# Altium schematic sheet Buck.SchDoc
size A4
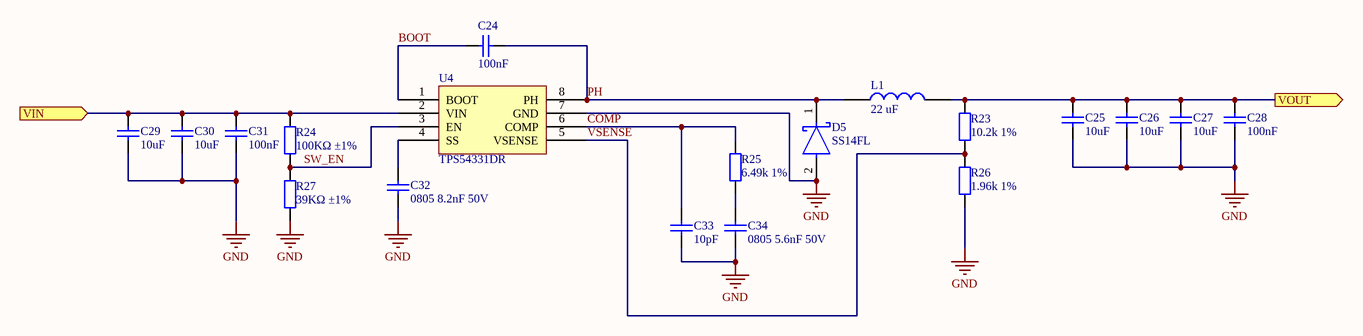
[diagram p0: Buck.SchDoc]

## Parts
C24  100nF  [0603_C]
C25  10uF  [0603_C]
C26  10uF  [0603_C]
C27  10uF  [0603_C]
C28  100nF  [0603_C]
C29  10uF  [0805_C]
C30  10uF  [0805_C]
C31  100nF  [0603_C]
C32  0805 8.2nF 50V  [0805_C]
C33  10pF  [0603_C]
C34  0805 5.6nF 50V  [0805_C]
D5  SS14FL  [FP-425AD-MFG]
L1  22 uF  [COBU-DR74-4R7-R_V]
R23  10.2k 1%  [1206_R]
R24  100KΩ ±1%  [0805_R]
R25  6.49k 1%  [0805_R]
R26  1.96k 1%  [1206_R]
R27  39KΩ ±1%  [0805_R]
U4  TPS54331DR  [SOIC-8_150mil]

## Ports
VIN (in), VOUT (out)

## Nets
GND: C25.1 C26.1 C27.1 C28.1 C29.1 C30.1 C31.1 C32.1 C33.1 C34.1 D5.2(A) R26.1 R27.1 U4.7(GND)
BOOT: C24.2 U4.1(BOOT)
COMP: C33.2 R25.2 U4.6(COMP)
PH: C24.1 D5.1(C) L1.1 U4.8(PH)
SW_EN: R24.2 R27.2 U4.3(EN)
VIN: C29.2 C30.2 C31.2 R24.1 U4.2(VIN) ; port VIN
VOUT: C25.2 C26.2 C27.2 C28.2 L1.2 R23.1 ; port VOUT
VSENSE: R23.2 R26.2 U4.5(VSENSE)
NetC32_2: C32.2 U4.4(SS)
NetC34_2: C34.2 R25.1

## Library data of the parts
C24 C28 C31 = 0603 100nF (104) 10% 50V: Chip capacitors; Manufacturer: YAGEO; PartNumber: CC0603KRX7R9BB104; Tolerance: 10%; Voltage: 50V; ComponentLink1Description: Supplier link; ComponentLink1URL: http://www.szlcsc.com/product/details_15331.html; Package: 0603; Supplier: LC; SuppliersPartNumber: C14663; Capacitance: 100nF
C25-C27 = 0603 10uF (106) 10% 10V: Chip capacitors; Manufacturer: Samsung Electro-Mechanics; PartNumber: CL10A106KP8NNNC; Tolerance: 10%; Voltage: 10V; ComponentLink1Description: Supplier link; ComponentLink1URL: http://www.szlcsc.com/product/details_20411.html; Package: 0603; Supplier: LC; SuppliersPartNumber: C19702; Capacitance: 10uF
C29 C30 = 0805 10uF (106) 10% 25V: Chip capacitors; Manufacturer: Samsung Electro-Mechanics; PartNumber: CL21A106KAYNNNE; Tolerance: 10%; Voltage: 25V; ComponentLink1Description: Supplier link; ComponentLink1URL: http://www.szlcsc.com/product/details_16532.html; Package: 0805; Supplier: LC; SuppliersPartNumber: C15850; Capacitance: 10uF
C32 = 0805 8.2nF 50V: PartNumber: CL21B822KBANNNC; LCSC: C170117
C33 = 0603 10pF (100) 5% 50V: Chip capacitors; Manufacturer: Samsung Electro-Mechanics; PartNumber: CL10C100JB8NNNC; Tolerance: 5%; Voltage: 50V; ComponentLink1Description: Supplier link; ComponentLink1URL: http://www.szlcsc.com/product/details_1986.html; Package: 0603; Supplier: LC; SuppliersPartNumber: C1634; Capacitance: 10pF
C34 = 0805 5.6nF 50V: PartNumber: CL21B562KBANNNC; LCSC: C153719
D5 = CMP-07162-000013-1: DIODE SCHOTTKY 40V 1A SOD123F; Manufacturer: ON Semiconductor; Max Junction Temp: +125°C; Value: 60pF; Max Surge Forward Current: 40A; Peak Reverse Current: 30uA; Device Class L3: Schottky Diodes; Reverse Voltage: 40V; Automotive: No; Temperature: -55°C to +125°C; Mouser Description: SS14FL Series 40 V 1 A Surface Mount Schottky Barrier Rectifier - SOD-123F; Octopart: https://octopart.com/ss14fl-on+semiconductor-84331601; Height: 1.08mm; Temperature Range Low: -55°C; Category: Diode; Lead Free: Yes; Device Class L1: Discrete Semiconductors; Digikey Description: DIODE SCHOTTKY 40V 1A SOD123F; RoHS: TRUE; ComponentLink2Description: Datasheet; Manufacturer Part Number: SS14FL; Forward Current: 1A; Capacitance: 60pF; Package: 425AD; Device Class L2: Diodes; Temperature Range High: +125°C; Max Repetitive Reverse Voltage: 40V; ComponentLink2URL: https://www.onsemi.com/pub/Collateral/SS14FL-D.PDF
L1 = SRP6540-5R6M
R23 = 1206 10.2k 1%: PartNumber: 1206W4F1022T5E; LCSC: C247410
R24 = 0805 100K (1003) 1%: Chip resistor; Manufacturer: Uniroyal Elec; Power: 1/8W; ComponentLink1Description: Supplier link; ComponentLink1URL: http://www.szlcsc.com/product/details_18095.html; Package: 0805; Supplier: LC; SuppliersPartNumber: C17407; Tolerance: 1%
R25 = 0805 6.49k 1%: PartNumber: 0805W8F6491T5E; LCSC: C17769
R26 = 1206 1.96k 1%: PartNumber: 1206W4F1022T5E; LCSC: C247410
R27 = 0805 39K (3902) 1%: Chip resistor; Manufacturer: Uniroyal Elec; Power: 1/8W; ComponentLink1Description: Supplier link; ComponentLink1URL: http://www.szlcsc.com/product/details_26569.html; Package: 0805; Supplier: LC; SuppliersPartNumber: C25826; Tolerance: 1%
U4 = TPS54331DR_[C9865]: DC-DC芯片; ComponentLink1Description: 供应商链接; ComponentLink1URL: http://www.szlcsc.com/product/details_10397.html; Package: SOIC-8_150mil; Supplier: LC; SuppliersPartNumber: C9865